# Altium schematic sheet OpenPLCv0.2.0_GPIOExpander.SchDoc
size 420 x 297 mm; PageSetup: Record=PageOptions|CenterHorizontal=True|CenterVertical=True|PrintScale=1.01|XCorrection=1.00|YCorrection=1.00|PrintKind=1|BorderSize=5000000|LeftOffset=0|BottomOffset=0|Orientation=2|PaperLength=1000|PaperWidth=1000|Scale=100|PaperSource=7|PrintQuality=-4|MediaType=1|DitherType=10|PaperKind=A3|PrintScaleMode=1; DocumentNumber: 22; SheetNumber: 22; SheetTotal: 22; SheetTitle: GPIO Expander
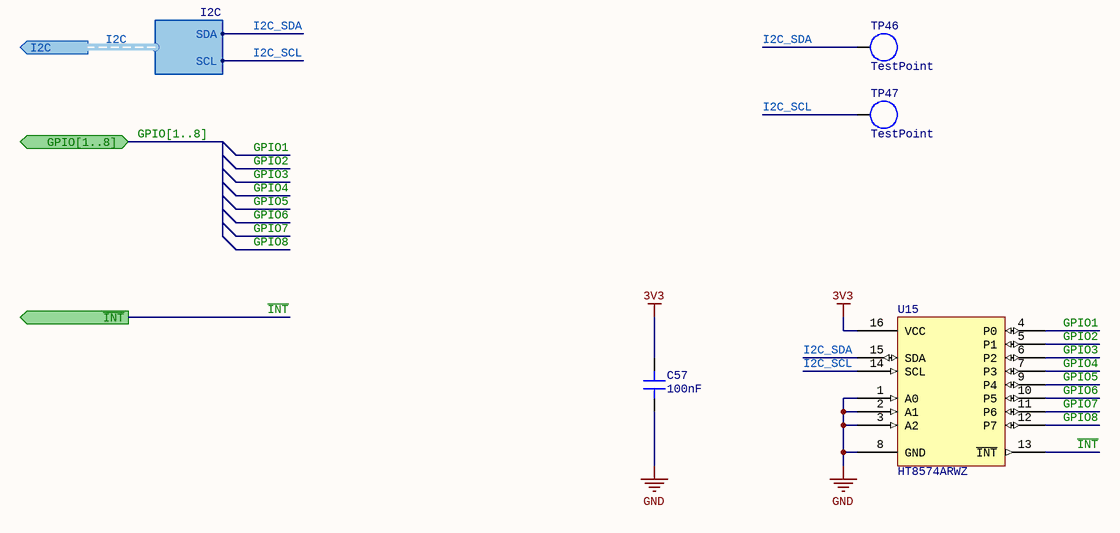
[diagram p0: OpenPLCv0.2.0_GPIOExpander.SchDoc]

## Parts
C57  Capacitance: 100nF  [SMD_CAP_0402(1005)_N]  (hidden comment: CC0402KRX5R6BB104)
TP46  TestPoint  [Pad]  (no BOM)
TP47  TestPoint  [Pad]  (no BOM)
U15  HT8574ARWZ  [TSSOP-16]

## Ports
GPIO[1..8] (bidir), I2C (out, harness I2C), ~{INT} (out)

## Harnesses
I2C: SDA, SCL

## Nets
3V3: C57.2 U15.16(VCC)
GND: C57.1 U15.1(A0) U15.2(A1) U15.3(A2) U15.8(GND)
GPIO1: U15.4(P0)
GPIO2: U15.5(P1)
GPIO3: U15.6(P2)
GPIO4: U15.7(P3)
GPIO5: U15.9(P4)
GPIO6: U15.10(P5)
GPIO7: U15.11(P6)
GPIO8: U15.12(P7)
I2C_SCL: TP47.1 U15.14(SCL) ; port I2C.SCL  [project net I2C.SCL]
I2C_SDA: TP46.1 U15.15(SDA) ; port I2C.SDA  [project net I2C.SDA]
~{INT}: U15.13(~{INT}) ; port ~{INT}

## Buses and harness runs
bus GPIO[1..8] = port GPIO[1..8]
harness I2C = port I2C

## Notes on the sheet
- FILE NAME
- PROJECT
- TITLE
- REV
- AUTHOR
- SIZE
- SHEET
- DATE
- OF
- A3

## Library data of the parts
C57 = 100nF 0402 10V 10%: 100nF ±10% 10V X5R 0402 Multilayer Ceramic Capacitors MLCC - SMD/SMT RoHS; Package: 0402; Tolerance: 10%; Voltage Rating: 10V
TP46 TP47 = Test point
U15 = HT8574ARWZ: SOP16 Interface - I/O Expanders ROHS (PCF8754 clone)